# EAGLE design macse (EAGLE 9.6.2)
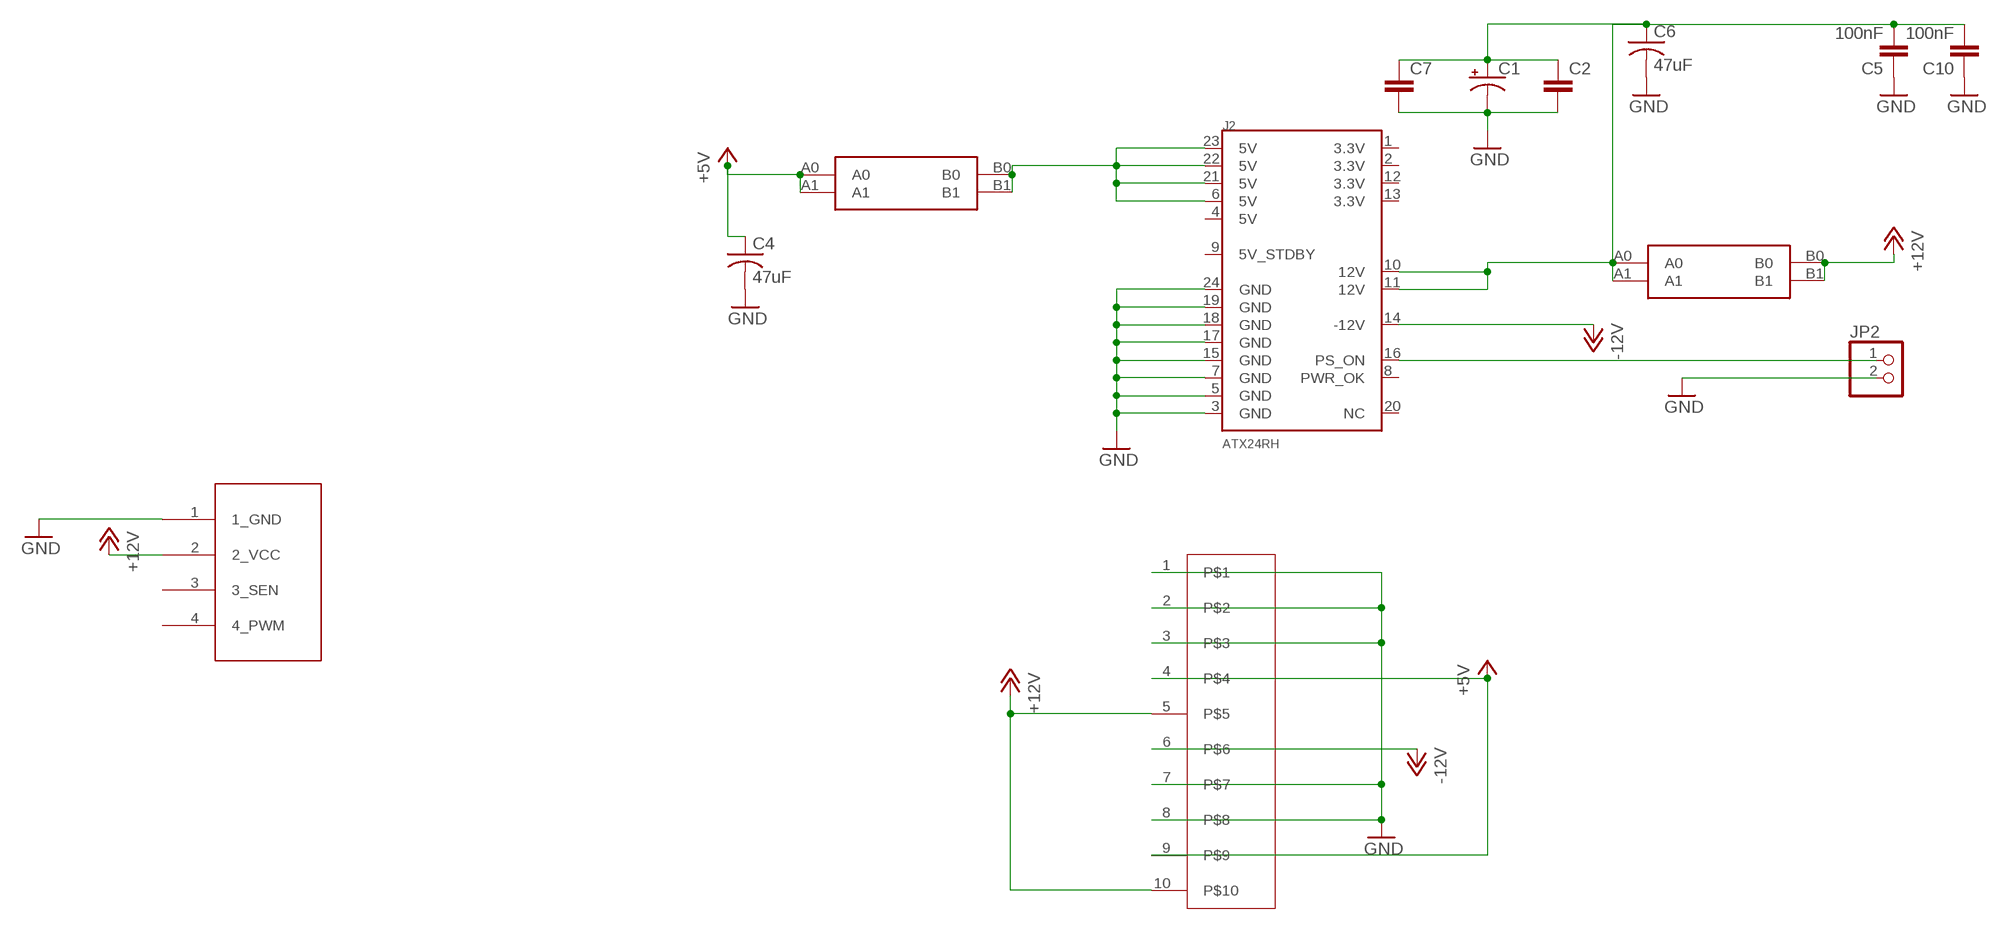
[diagram p0: schematic, sheet 1]

## Parts
C1  CPOL-USE3.5-8  [E3,5-8]
C2  C5/2.5  [C5B2.5]
C4  47uF  C-USC1210  [C1210]
C5  100nF  CAP0805  [0805@1]
C6  47uF  C-USC1210  [C1210]
C7  C5/2.5  [C5B2.5]
C10  100nF  CAP0805  [0805@1]
J2  ATX24RH  [ATX24_RIGHT_ANGLE]
JP2  PINHD-1X2/90  [1X02/90]
JP3  4PIN_FAN  [1X04]
U$1  MACSE  [MACSE_10P_STRAIGHT]
U$2  CAR_FUSE_HOLDER3IN1  [FUSE_HOLDER_3IN1]
U$8  CAR_FUSE_HOLDER3IN1  [FUSE_HOLDER_3IN1]

## Nets
+5V: C4.1 U$1.4 U$1.9 U$8.A0 U$8.A1
+12V: JP3.2(2_VCC) U$1.5 U$1.10 U$2.B0 U$2.B1
-12V: J2.14(-12V) U$1.6
GND: C1.- C2.2 C4.2 C5.1 C6.2 C7.2 C10.1 J2.3(GND) J2.5(GND) J2.7(GND) J2.15(GND) J2.17(GND) J2.18(GND) J2.19(GND) J2.24(GND) JP2.2 JP3.1(1_GND) U$1.1 U$1.2 U$1.3 U$1.7 U$1.8
N$5: J2.16(PS_ON) JP2.1
N$6: J2.6(5V) J2.21(5V) J2.22(5V) J2.23(5V) U$8.B0 U$8.B1
N$8: C1.+ C2.1 C5.2 C6.1 C7.1 C10.2 J2.10(12V) J2.11(12V) U$2.A0 U$2.A1
Unconnected: J2.1(3.3V) J2.2(3.3V) J2.4(5V) J2.8(PWR_OK) J2.9(5V_STDBY) J2.12(3.3V) J2.13(3.3V) J2.20(NC) JP3.3(3_SEN) JP3.4(4_PWM)

## Library data of the parts
C1 = adafruit_changed:CPOL-US: POLARIZED CAPACITOR, American symbol
C2 C7 = capacitor-wima:C: CAPACITOR naming: grid - package width
C4 C6 = clock:C-US: CAPACITOR, American symbol
C5 C10 = clock:CAP: Capacitor Standard 0603 ceramic capacitor, and 0.1" leaded capacitor.
J2 = macse:ATX24: ATX24 Pin Power Supply Connector This is a good connector for connecting a computer power supply to a PCB. It's massive, but provides many amps of power at 5V and 12V. SKU: PRT-09498
JP2 = pinhead:PINHD-1X2: PIN HEADER
JP3 = appleii:4PIN_FAN: PIN HEADER
U$1 = atx4vc:MACSE
U$2 U$8 = atx_power_control:CAR_FUSE_HOLDER

## Board
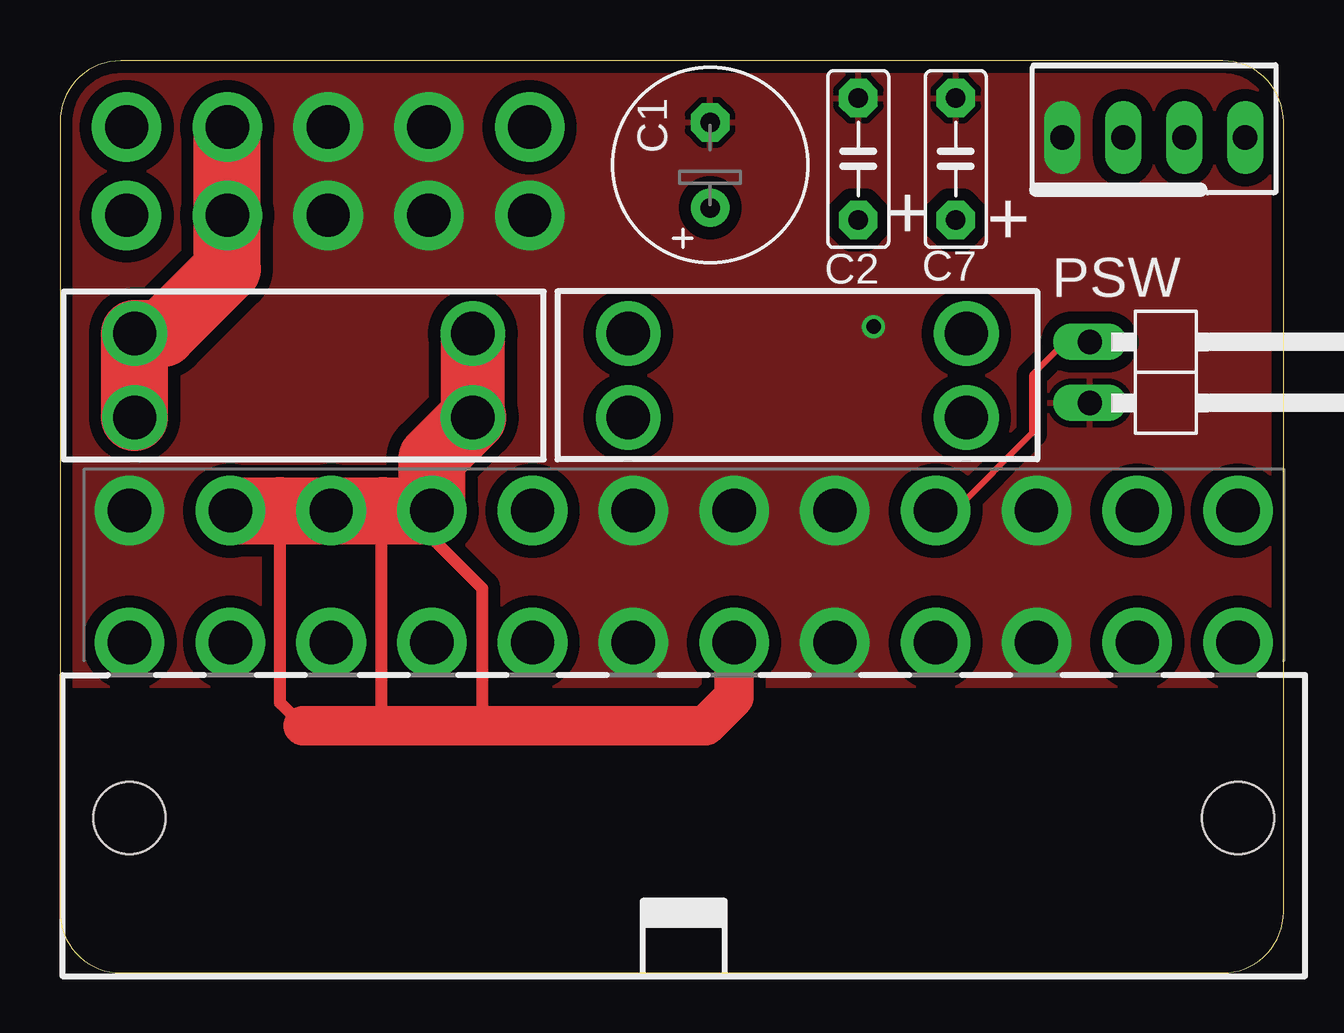
[diagram p1: board, top side]
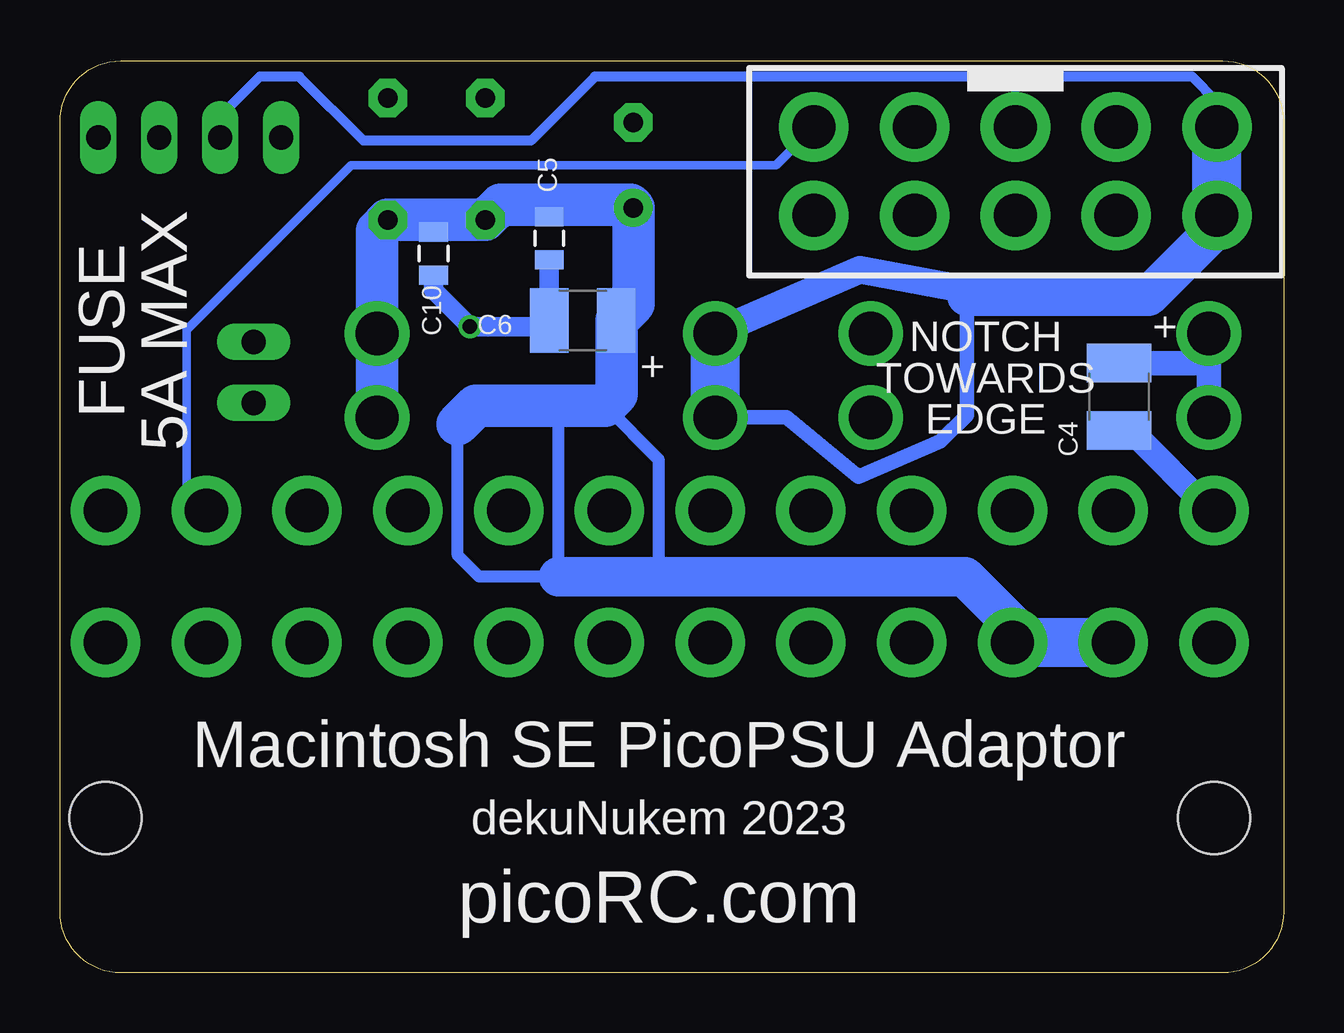
[diagram p2: board, bottom side, seen from below]

Size 51 x 38 mm. Coordinates in mm from the lower left corner, seen from the top.
Outline: 0,35.46 0,2.54 arc90 2.54,0 48.46,0 arc90 51,2.54 51,35.46 arc90 48.46,38 2.54,38 arc90 0,35.46
Copper layers (1*16): Top 0.035mm / dielectric 1.5mm / Bottom 0.035mm
Design rules "deku_2layer_6mil *": minimum track width 6mil, minimum drill 15mil, track to track 20mil, track to pad 6mil, pad to pad 6mil, via to via 6mil, smd to smd 6mil, copper to edge 10mil, drill to drill 6mil, minimum pad ring 7mil, minimum via ring 7mil, stop-mask expansion 4mil, vias tented up to drill 25mil, thermal gap 10mil

### Footprints (pad centres in the part's own frame; a part is rotated, then mirrored left to right if it is on the bottom)
E3,5-8 = drill 0.813 pad 1.6: + -1.778,0 | drill 0.813 pad 1.6 octagon: - 1.778,0
C5B2.5 = drill 0.813 pad 1.6 octagon: 1 -2.54,0; 2 2.54,0
C1210 = smd 1.6 x 2.7: 1 -1.4,0; 2 1.4,0
0805@1 = smd 0.8 x 1.2: 1 -0.9,0; 2 0.9,0
ATX24_RIGHT_ANGLE = drill 1.8 pad 2.9: 1 23.1,4.76; 2 18.9,4.76; 3 14.7,4.76; 4 10.5,4.76; 5 6.3,4.76; 6 2.1,4.76; 7 -2.1,4.76; 8 -6.3,4.76; 9 -10.5,4.76; 10 -14.7,4.76; 11 -18.9,4.76; 12 -23.1,4.76; 13 23.1,10.26; 14 18.9,10.26; 15 14.7,10.26; 16 10.5,10.26; 17 6.3,10.26; 18 2.1,10.26; 19 -2.1,10.26; 20 -6.3,10.26; 21 -10.5,10.26; 22 -14.7,10.26; 23 -18.9,10.26; 24 -23.1,10.26 | hole 3: -23.1,-2.54; 23.1,-2.54
1X02/90 = drill 1.016 long: 1 -1.27,-3.81; 2 1.27,-3.81
1X04 = drill 1.016 long: 1 -3.81,0; 2 -1.27,0; 3 1.27,0; 4 3.81,0
MACSE_10P_STRAIGHT = drill 1.8 pad 2.9: 1 8.4,-1.84; 2 4.2,-1.84; 3 0,-1.84; 4 -4.2,-1.84; 5 -8.4,-1.84; 6 8.4,1.84; 7 4.2,1.84; 8 0,1.84; 9 -4.2,1.84; 10 -8.4,1.84
FUSE_HOLDER_3IN1 = drill 1.8: A0 -7.05,1.75; A1 -7.05,-1.75; B0 7.05,1.75; B1 7.05,-1.75

### Placement (x,y rotation side)
C1  27.1,33.66 90 top
C2  33.27,33.91 90 top
C4  6.86,24 270 bottom
C5  30.61,30.61 90 bottom
C6  29.21,27.18 180 bottom
C7  37.34,33.91 90 top
C10  35.43,29.97 90 bottom
J2  26,9 0 top
JP2  46.74,25.02 270 top
JP3  45.59,34.8 0 top
U$1  11.18,33.4 0 top
U$2  30.73,24.89 180 top
U$8  10.16,24.89 0 top

### Tracks (layer width: path | path; a pad name or v marks a point on that pad's centre or on a via)
+5V
  Top 0.508: U$1.9 6.98,36.13
  Top 2.794: U$8.A1 U$8.A0 4.29,26.64 6.98,29.33 U$1.4 U$1.9
  Bottom 1.016: U$8.A0 3.11,25.4 | 3.11,25.4 U$8.A1 | C4.1 3.11,25.4
+12V
  Bottom 0.406: U$1.10 2.78,36.3 3.81,37.34 28.7,37.34 31.37,34.67 38.35,34.67 41.02,37.34 42.67,37.34 44.32,35.69 JP3.2
  Bottom 0.508: U$2.B1 23.18,27.15
  Bottom 0.61: U$2.B0 20.72,23.14 17.73,20.66 14.3,22.15 13.21,23.24 13.21,28.19
  Bottom 1.143: U$2.B1 23.62,26.71 17.65,29.29 12.41,28.32
  Bottom 1.524: 2.78,31.05 U$1.5
  Bottom 1.651: 2.78,31.05 5.63,28.19 13.21,28.19
  Bottom 2.032: U$1.5 U$1.10 | U$2.B0 U$2.B1
-12V
  Bottom 0.356: J2.14 45.72,20.08 45.72,26.8 38.86,33.66 21.16,33.66 U$1.6
GND  (via drill 0.6)
  Bottom 0.813: C5.1 C6.2 30.86,26.92 v33.91,26.92 35.43,28.45 C10.1
  Bottom 1.016: J2.24 3.03,19.26 6.37,22.6 C4.2
  pour Top (isolate 0.508): 51,38 0,38 0,11.94 51,11.94
N$5
  Top 0.254: J2.16 37.29,19.26 40.51,22.48 40.51,24.89 41.91,26.29 JP2.1
N$6
  Top 0.508: J2.21 15.5,18.12 17.6,16.02 17.6,10.29 | 13.46,19.26 13.39,19.26 13.39,10.29 | 10.13,10.29 9.17,11.25 9.17,19.26
  Top 1.651: J2.6 28.1,11.47 26.91,10.29 17.6,10.29 13.39,10.29 10.13,10.29
  Top 2.667: U$8.B1 U$8.B0
  Top 2.794: J2.23 9.17,19.26 J2.22 13.46,19.26 J2.21 15.5,21.43 U$8.B1
N$8
  Bottom 0.356: C10.2 35.93,31.37 C7.1 | C5.2 33.14,31.51 C2.1
  Bottom 0.508: 26.04,16.51 26.04,21.36 28.29,23.62 | 30.23,22.98 30.23,16.51 33.53,16.51 34.42,17.4 34.42,22.86
  Bottom 1.651: J2.10 11.3,14.52 13.29,16.51 26.04,16.51 30.23,16.51
  Bottom 1.778: U$2.A0 U$2.A1 37.78,30.92 C7.1 C2.1 32.64,32 27.23,32 C1.+ 27.1,27.89 C6.1 27.81,24.1 28.29,23.62 33.66,23.62 34.42,22.86
  Bottom 2.032: J2.11 J2.10

### Text on the board
tNames: + | + | PSW
bNames: FUSE / 5A MAX | NOTCH / TOWARDS / EDGE | Macintosh SE PicoPSU Adaptor | dekuNukem 2023 | picoRC.com